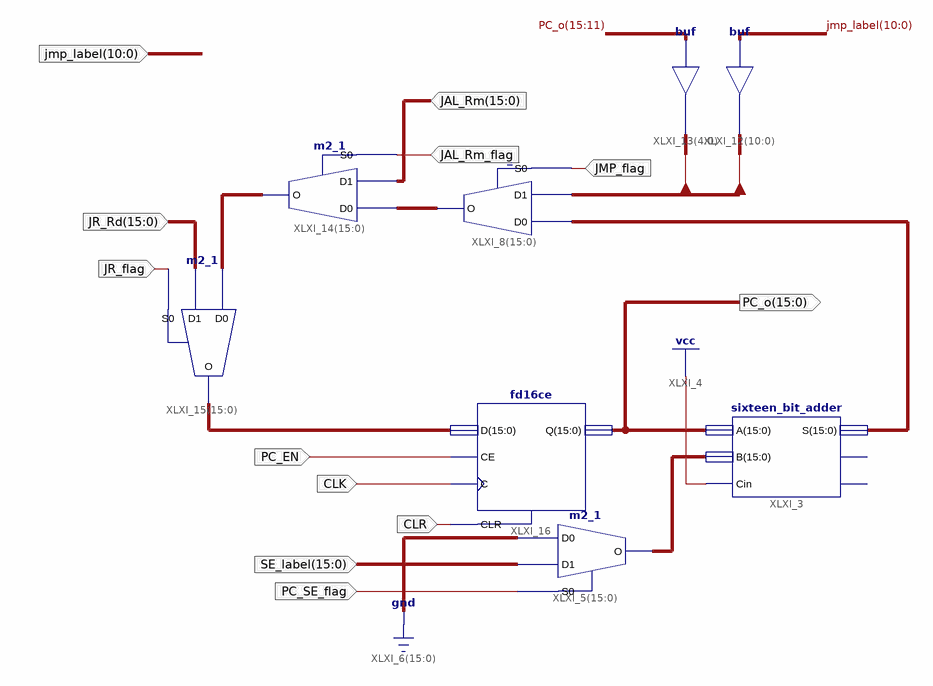
[diagram p0: schematic sheet 1]
// Xilinx ISE schematic PC.sch (artix7) as structural Verilog: 8 symbols, 12 ports
module PC (
  input  CLK,
  input  [15:0] SE_label,
  input  PC_SE_flag,
  input  JMP_flag,
  input  [10:0] jmp_label,
  input  JAL_Rm_flag,
  input  [15:0] JAL_Rm,
  input  JR_flag,
  input  [15:0] JR_Rd,
  input  PC_EN,
  input  CLR,
  output [15:0] PC_o
);

  wire [15:0] pl, XLXN_11, XLXN_16, XLXN_30, XLXN_31, XLXN_37;

  sixteen_bit_adder XLXI_3 (.A(PC_o), .B(XLXN_11), .Cin(1'b1), .S(XLXN_16));  // open: Co, V
  m2_1 XLXI_5[15:0] (.D0({16{1'b0}}), .D1(SE_label), .S0(PC_SE_flag), .O(XLXN_11));
  m2_1 XLXI_8[15:0] (.D0(XLXN_16), .D1(pl), .S0(JMP_flag), .O(XLXN_31));
  assign pl[10:0] = jmp_label;  // buf XLXI_12[10..0], 11 bits wide
  assign pl[15:11] = PC_o[15:11];  // buf XLXI_13[4..0], 5 bits wide
  m2_1 XLXI_14[15:0] (.D0(XLXN_31), .D1(JAL_Rm), .S0(JAL_Rm_flag), .O(XLXN_30));
  m2_1 XLXI_15[15:0] (.D0(XLXN_30), .D1(JR_Rd), .S0(JR_flag), .O(XLXN_37));
  fd16ce XLXI_16 (.C(CLK), .CE(PC_EN), .CLR(CLR), .D(XLXN_37), .Q(PC_o));
endmodule
